# EAGLE schematic voice board kombi smd (EAGLE 7.2.0)
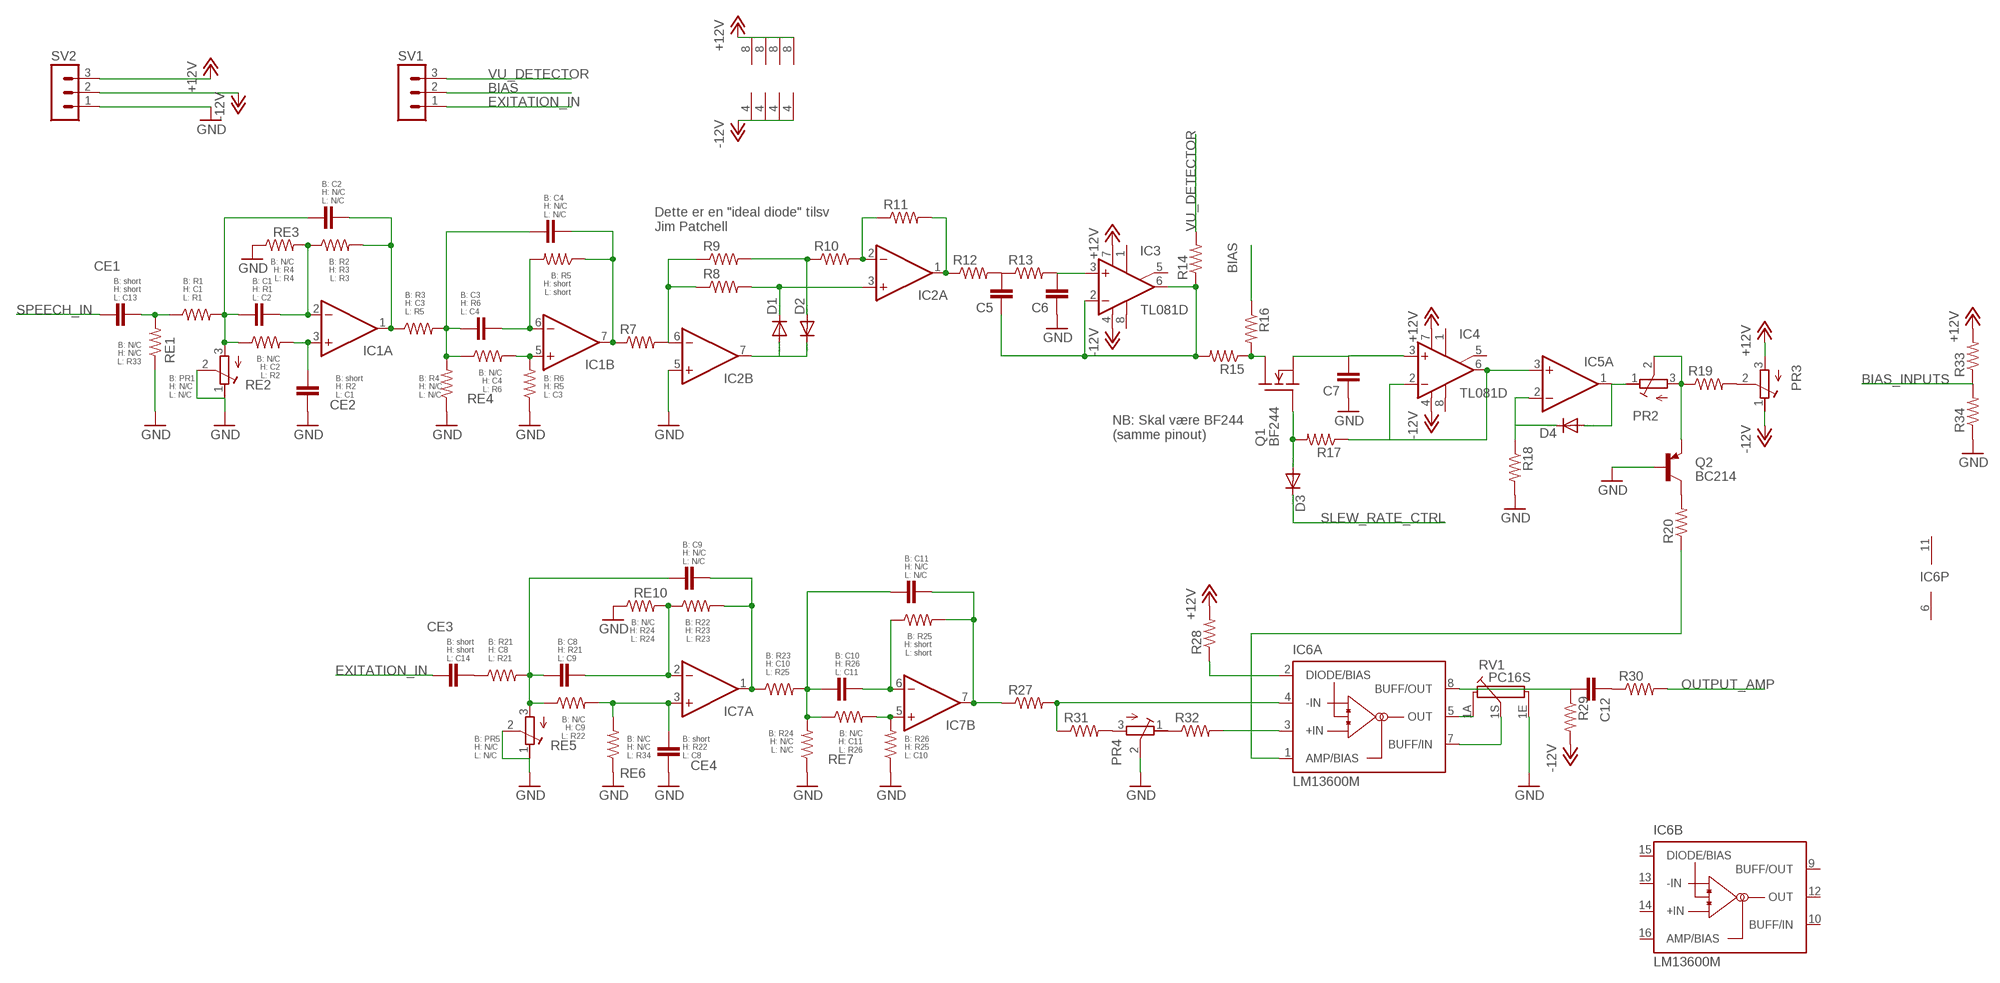
[diagram p0: schematic, sheet 1]

## Parts
C1  C-EUC0805  [C0805]
C2  C-EUC0805  [C0805]
C3  C-EUC0805  [C0805]
C4  C-EUC0805  [C0805]
C5  C-EUC0805  [C0805]
C6  C-EUC0805  [C0805]
C7  C-EUC0805  [C0805]
C8  C-EUC0805  [C0805]
C9  C-EUC0805  [C0805]
C10  C-EUC0805  [C0805]
C11  C-EUC0805  [C0805]
C12  C-EUC0805  [C0805]
CE1  C-EUC0805  [C0805]
CE2  C-EUC0805  [C0805]
CE3  C-EUC0805  [C0805]
CE4  C-EUC0805  [C0805]
D1  DIODE-SOD80C  [SOD80C]
D2  DIODE-SOD80C  [SOD80C]
D3  DIODE-SOD80C  [SOD80C]
D4  DIODE-SOD80C  [SOD80C]
IC1  TL072D  [SO08]
IC2  TL072D  [SO08]
IC3  TL081D  [SO08]
IC4  TL081D  [SO08]
IC5  TL072D  [SO08]
IC6  LM13600M  [SO16]
IC7  TL072D  [SO08]
PR1  R-TRIMMT93XA  [RTRIMT93XA]
PR2  R-TRIMMT93XA  [RTRIMT93XA]
PR3  R-TRIMMT93XA  [RTRIMT93XA]
PR4  R-TRIMMT93XA  [RTRIMT93XA]
PR5  R-TRIMMT93XA  [RTRIMT93XA]
Q1  BF244  TN0602N3  [TO-92]
Q2  BC214  [TO92]
R1  R-US_R0805  [R0805]
R2  R-US_R0805  [R0805]
R3  R-US_R0805  [R0805]
R4  R-US_R0805  [R0805]
R5  R-US_R0805  [R0805]
R6  R-US_R0805  [R0805]
R7  R-US_R0805  [R0805]
R8  R-US_R0805  [R0805]
R9  R-US_R0805  [R0805]
R10  R-US_R0805  [R0805]
R11  R-US_R0805  [R0805]
R12  R-US_R0805  [R0805]
R13  R-US_R0805  [R0805]
R14  R-US_R0805  [R0805]
R15  R-US_R0805  [R0805]
R16  R-US_R0805  [R0805]
R17  R-US_R0805  [R0805]
R18  R-US_R0805  [R0805]
R19  R-US_R0805  [R0805]
R20  R-US_R0805  [R0805]
R21  R-US_R0805  [R0805]
R22  R-US_R0805  [R0805]
R23  R-US_R0805  [R0805]
R24  R-US_R0805  [R0805]
R25  R-US_R0805  [R0805]
R26  R-US_R0805  [R0805]
R27  R-US_R0805  [R0805]
R28  R-US_R0805  [R0805]
R29  R-US_R0805  [R0805]
R30  R-US_R0805  [R0805]
R31  R-US_R0805  [R0805]
R32  R-US_R0805  [R0805]
R33  R-US_R0805  [R0805]
R34  R-US_R0805  [R0805]
RE1  R-US_R0805  [R0805]
RE2  R-US_R0805  [R0805]
RE3  R-US_R0805  [R0805]
RE4  R-US_R0805  [R0805]
RE5  R-US_R0805  [R0805]
RE6  R-US_R0805  [R0805]
RE7  R-US_R0805  [R0805]
RE10  R-US_R0805  [R0805]
RV1  PC16S  [PC16S]
SV1  MA03-1  [MA03-1]
SV2  MA03-1  [MA03-1]

## Nets
+12V: IC1.8(P:V+) IC2.8(P:V+) IC3.7(V+) IC4.7(V+) IC5.8(P:V+) IC7.8(P:V+) PR3.3(A) R28.2 R33.2 SV2.3
-12V: IC1.4(P:V-) IC2.4(P:V-) IC3.4(V-) IC4.4(V-) IC5.4(P:V-) IC7.4(P:V-) PR3.1(E) R29.2 SV2.2
BIAS: R16.1 SV1.2
BIAS_INPUTS: R33.1 R34.2
EXITATION_IN: CE3.1 SV1.1
GND: C6.1 C7.1 CE2.1 CE4.1 IC2.5(B:+IN) PR1.1(E) PR1.2(S) PR4.2(S) PR5.1(E) PR5.2(S) Q2.2(B) R4.1 R6.1 R18.2 R24.1 R26.1 R34.1 RE1.1 RE3.1 RE6.1 RE10.1 RV1.1E SV2.1
N$1: C1.2 IC1.2(A:-IN) R2.1 RE3.2
N$2: C1.1 C2.1 PR1.3(A) R1.2 RE2.1
N$3: C2.2 IC1.1(A:OUT) R2.2 R3.1
N$4: IC2.6(B:-IN) R7.2 R8.1 R9.1
N$5: C3.1 C4.1 R3.2 R4.2 RE4.1
N$6: C3.2 IC1.6(B:-IN) R5.2
N$7: IC1.5(B:+IN) R6.2 RE4.2
N$8: C4.2 IC1.7(B:OUT) R5.1 R7.1
N$9: D1.C IC2.3(A:+IN) R8.2
N$10: D1.A D2.C IC2.7(B:OUT)
N$11: D2.A R9.2 R10.1
N$12: IC2.2(A:-IN) R10.2 R11.1
N$13: IC2.1(A:OUT) R11.2 R12.1
N$14: C5.2 R12.2 R13.1
N$15: C5.1 IC3.2(-IN) IC3.6(OUT) R14.1 R15.2
N$16: C6.2 IC3.3(+IN) R13.2
N$17: Q1.3(D) R15.1 R16.2
N$18: C7.2 IC4.3(+IN) Q1.1(S)
N$19: D3.A Q1.2(G) R17.2
N$20: IC4.2(-IN) IC4.6(OUT) IC5.3(A:+IN) R17.1
N$21: D4.C IC5.2(A:-IN) R18.1
N$22: D4.A IC5.1(A:OUT) PR2.1(E)
N$23: PR2.2(S) PR2.3(A) Q2.1(E) R19.1
N$24: PR3.2(S) R19.2
N$25: Q2.3(C) R20.2
N$26: PR4.3(A) R31.2
N$27: C8.2 C9.2 PR5.3(A) R21.2 RE5.1
N$28: C10.2 C11.2 R23.2 R24.2 RE7.1
N$29: C8.1 IC7.2(A:-IN) R22.1 RE10.2
N$30: C9.1 IC7.1(A:OUT) R22.2 R23.1
N$31: C10.1 IC7.6(B:-IN) R25.1
N$32: IC7.5(B:+IN) R26.2 RE7.2
N$33: C12.2 IC6.8(A:BUFF/OUT) R29.1
N$34: C12.1 R30.1
N$35: C11.1 IC7.7(B:OUT) R25.2 R27.1
N$36: PR4.1(E) R32.1
N$37: IC6.3(A:+IN) R32.2
N$38: IC6.2(A:DIODE/BIAS) R28.1
N$39: IC6.4(A:-IN) R27.2 R31.1
N$40: IC6.1(A:AMP/BIAS) R20.1
N$41: IC6.5(A:OUT) RV1.1A
N$42: IC6.7(A:BUFF/IN) RV1.1S
N$43: CE1.2 R1.1 RE1.2
N$44: CE2.2 IC1.3(A:+IN) RE2.2
N$45: CE3.2 R21.1
N$46: CE4.2 IC7.3(A:+IN) RE5.2 RE6.2
OUTPUT_AMP: R30.2
SLEW_RATE_CTRL: D3.C
SPEECH_IN: CE1.1
VU_DETECTOR: R14.2 SV1.3
Unconnected: IC3.1(ON1) IC3.5(ON2) IC3.8(OPT) IC4.1(ON1) IC4.5(ON2) IC4.8(OPT) IC5.5(B:+IN) IC5.6(B:-IN) IC5.7(B:OUT) IC6.9(B:BUFF/OUT) IC6.10(B:BUFF/IN) IC6.12(B:OUT) IC6.13(B:-IN) IC6.14(B:+IN) IC6.15(B:DIODE/BIAS) IC6.16(B:AMP/BIAS)

## Notes on the sheet
- B: C2
  H: N/C
  L: N/C
- B: C4
  H: N/C
  L: N/C
- Dette er en "ideal diode" tilsv
  Jim Patchell
- B: N/C
  H: R4
  L: R4
- B: R2
  H: R3
  L: R3
- B: R5
  H: short
  L: short
- B: short
  H: short
  L: C13
- B: R1
  H: C1
  L: R1
- B: C1
  H: R1
  L: C2
- B: R3
  H: C3
  L: R5
- B: C3
  H: R6
  L: C4
- B: N/C
  H: N/C
  L: R33
- B: N/C
  H: C2
  L: R2
- B: N/C
  H: C4
  L: R6
- B: PR1
  H: N/C
  L: N/C
- B: short
  H: R2
  L: C1
- B: R4
  H: N/C
  L: N/C
- B: R6
  H: R5
  L: C3
- NB: Skal være BF244
  (samme pinout)
- B: C9
  H: N/C
  L: N/C
- B: C11
  H: N/C
  L: N/C
- B: N/C
  H: R24
  L: R24
- B: R22
  H: R23
  L: R23
- B: R25
  H: short
  L: short
- B: short
  H: short
  L: C14
- B: R21
  H: C8
  L: R21
- B: C8
  H: R21
  L: C9
- B: R23
  H: C10
  L: R25
- B: C10
  H: R26
  L: C11
- B: N/C
  H: C9
  L: R22
- B: R24
  H: N/C
  L: N/C
- B: N/C
  H: C11
  L: R26
- B: PR5
  H: N/C
  L: N/C
- B: N/C
  H: N/C
  L: R34
- B: short
  H: R22
  L: C8
- B: R26
  H: R25
  L: C10

## Power pins joined to a net without a drawn wire
V+: IC6.11(P:V+)
V-: IC6.6(P:V-)

## Library data of the parts
C1-C12 CE1-CE4 = resistor:C-EU: CAPACITOR, European symbol
D1-D4 = diode:DIODE-: DIODE
IC1 IC2 IC5 IC7 = linear:TL072: OP AMP
IC3 IC4 = linear:TL081: OP AMP
IC6 = national-semiconductor:LM13600: Dual Operational Transconductance Amplifiers with Linearizing Diodes and Buffers Source: lm13600.PDF
PR1-PR5 = resistor:R-TRIMM: Trimm resistor
Q1 = transistor-fet:TN0602N3: N-Channel Enhancement MOSFET 20V; 4A; 0,75Ohm
Q2 = transistor-pnp:BC214: PNP Transistor
R1-R34 RE1-RE7 RE10 = resistor:R-US_: RESISTOR, American symbol
RV1 = piher:PC16S: POTENTIOMETER single carbon potentiometer, 16 mm, S3ROH; OC_FARNELL: 4452940; OC_NEWARK: unknown
SV1 SV2 = con-lstb:MA03-1: PIN HEADER; OC_FARNELL: unknown; OC_NEWARK: unknown